# Altium project Shift Relays.PrjPcb
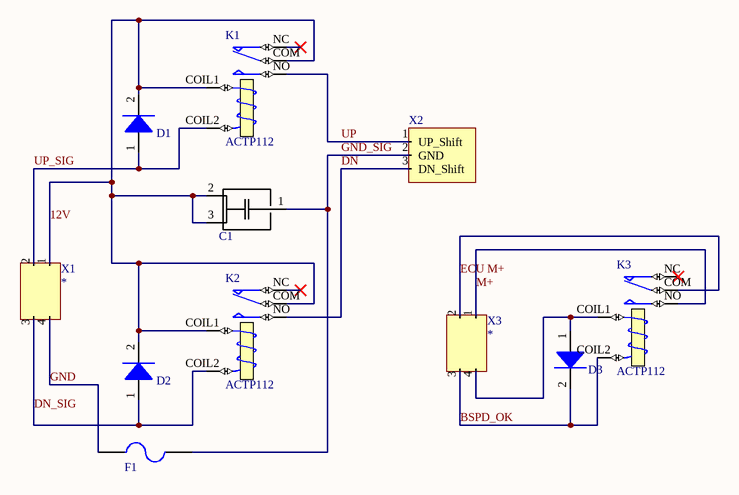
[diagram p0: shift_relays.SchDoc]
1 sheet, 11 parts. Net scope: global (net labels, ports and power ports of the same name join across sheets).
Board file: Shift_Relays.PcbDoc

## Sheet shift_relays.SchDoc
size A

### Parts
C1  Part Number: BZ05FB682ZSB  [BZX5-S]  (value not drawn)
D1  *  [SOD123F]  (value not drawn)
D2  *  [SOD123F]  (value not drawn)
D3  *  [SOD123F]  (value not drawn)
F1  Fuse  [3568-MiniFuseHolder]  (value not drawn)
K1  ACTP112  [ACTP112]
K2  ACTP112  [ACTP112]
K3  ACTP112  [ACTP112]
X1  *  [DTF13-4P]
X2  (no value)  [CONN_Shift]
X3  *  [DTF13-4P]

### Nets
12V: C1.2 C1.3 D1.2(K) D2.2(K) K1.COIL1(T1) K1.COM K2.COIL1(T1) K2.COM X1.1
BSPD_OK: D3.2(K) K3.COIL2(T2) X3.3
DN: K2.NO X2.3(DN_Shift)
DN_SIG: D2.1(A) K2.COIL2(T2) X1.3
ECU M+: K3.COM X3.2
GND: F1.1 X1.4
GND_SIG: C1.1 F1.2 X2.2(GND)
M+: K3.NO X3.1
UP: K1.NO X2.1(UP_Shift)
UP_SIG: D1.1(A) K1.COIL2(T2) X1.2
NetD3_1: D3.1(A) K3.COIL1(T1) X3.4

Not connected (* = marked no-connect by the designer): K1 NC*; K2 NC*; K3 NC*

### Library data of the parts
C1 = 11: 6.8mF (EDLC) Supercapacitor 15V BZ05, 3 Lead; Vendor: AVX Corporation; Built_By: EMA_UL_Team; Type: DEV; id: 11; voltage: 15; percent tolerance: 80; ESR: 1; Manufacturer_Part_Number: BZ05FB682ZSB; Copyright: Copyright (C) 2018 Accelerated Designs. All rights reserved; RefDes: RefDes; Value: Value; name: BZ05FB682ZSB; package: Surface Mount; quantity: 0; link: https://www.digikey.com/products/en/capacitors/electric-double-layer-capacitors-edlc-supercapacitors/61?k=&pkeyword=&sv=0&pv2049=u6.8mF&sf=1&FV=-8%7C61&quantity=&ColumnSort=0&page=1&pageSize=25; createdby: Patrick Reedy; createddate: 1/11/2020 3:48:08 PM
D1-D3 = 2: Diode Super Barrier 40V 1A Surface Mount SOD-; id: 2; name: 1N5819; mfrpartno: *; package: SOD-123; quantity: 0; link: https://www.digikey.com/product-detail/en/diodes-incorporated/1N5819HW1-7-F/1N5819HW1-7-FDITR-ND/5768523
F1 = 3: id: 3; Name: 3568 Mini Fuse Holder; itrip: 0; iinterrupt: 0; vmax: 0; quantity: 0; link: https://www.digikey.com/product-detail/en/keystone-electronics/3568/36-3568-ND/2137306
K1-K3 = 1: id: 1; current: 0; voltage: 12; Published: 8-Jun-2000; LatestRevisionDate: 17-Jul-2002; LatestRevisionNote: Re-released for DXP Platform.; PackageReference: MODULE5B; Publisher: Altium Limited; name: ACTP112; quantity: 0; link: https://www.digikey.com/product-detail/en/panasonic-electric-works/ACTP112/255-5163-ND/4691838; createdby: Kevin
X1 X3 = 15: DTF13-4P; id: 15; numcontacts: 4; MfrPartNo: *; name: DTF13-4P; quantity: 0; link: https://www.te.com/usa-en/product-DTF13-4P.html
X2 = 31: Connector for Shift Relays; id: 31; numcontacts: 3; name: CONN Shift; quantity: 0; createdby: Patrick